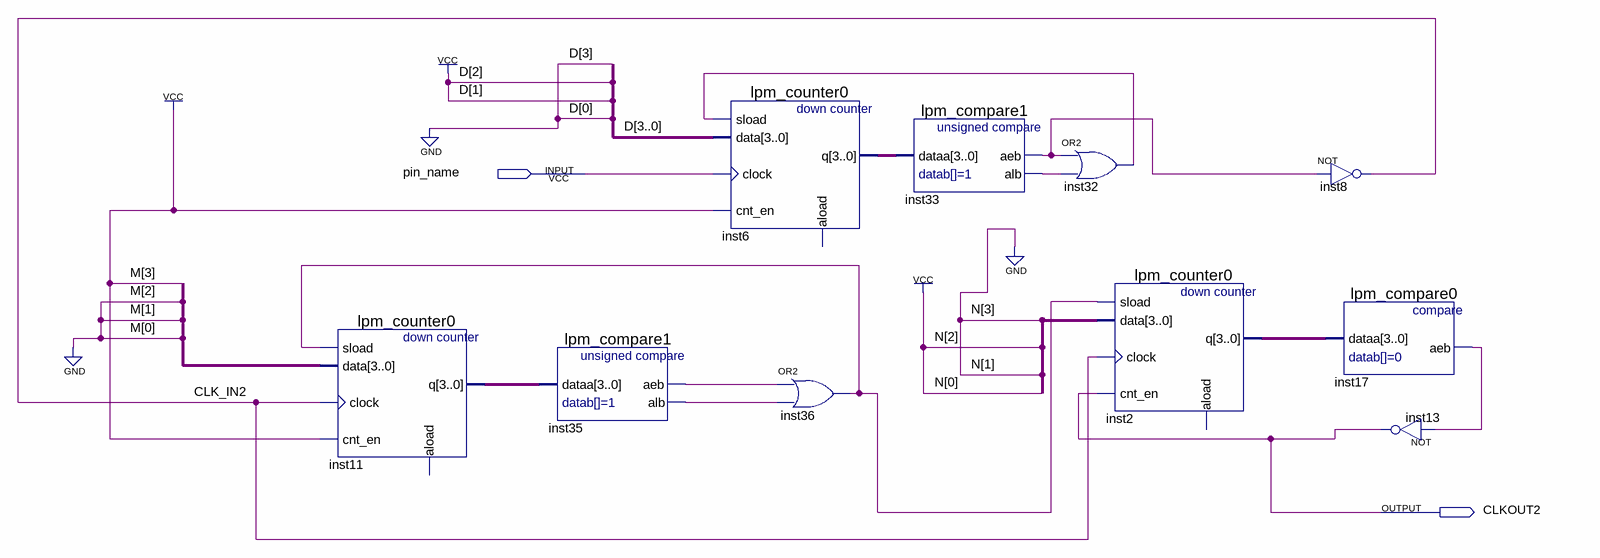
[diagram p0: schematic sheet]
// Quartus schematic Block2.bdf as structural Verilog: 10 symbols, 2 pins
module Block2 (
  input  pin_name,
  output CLKOUT2
);

  wire CLK_IN2, inst17_aeb, inst32_out, inst33_aeb, inst33_alb, inst35_aeb, inst35_alb, inst36_out;
  wire [3:0] inst2_q, inst6_q, inst11_q;

  lpm_counter0 inst11 (
    .sload(inst36_out), .data(4'b1000), .clock(CLK_IN2), .cnt_en(1'b1), .q(inst11_q));  // open: aload
  lpm_compare1 inst35 (.dataa(inst11_q), .aeb(inst35_aeb), .alb(inst35_alb));
  lpm_counter0 inst6 (.sload(inst32_out), .data(4'b0110), .clock(pin_name), .cnt_en(1'b1), .q(inst6_q));  // open: aload
  or inst36 (inst36_out, inst35_aeb, inst35_alb);
  lpm_compare1 inst33 (.dataa(inst6_q), .aeb(inst33_aeb), .alb(inst33_alb));
  or inst32 (inst32_out, inst33_aeb, inst33_alb);
  lpm_counter0 inst2 (
    .sload(inst36_out), .data(4'b0101), .clock(CLK_IN2), .cnt_en(CLKOUT2), .q(inst2_q));  // open: aload
  not inst8 (CLK_IN2, inst33_aeb);
  lpm_compare0 inst17 (.dataa(inst2_q), .aeb(inst17_aeb));
  not inst13 (CLKOUT2, inst17_aeb);
endmodule
